# EAGLE design BMS_Rev3_SSR (EAGLE 6.5.0)
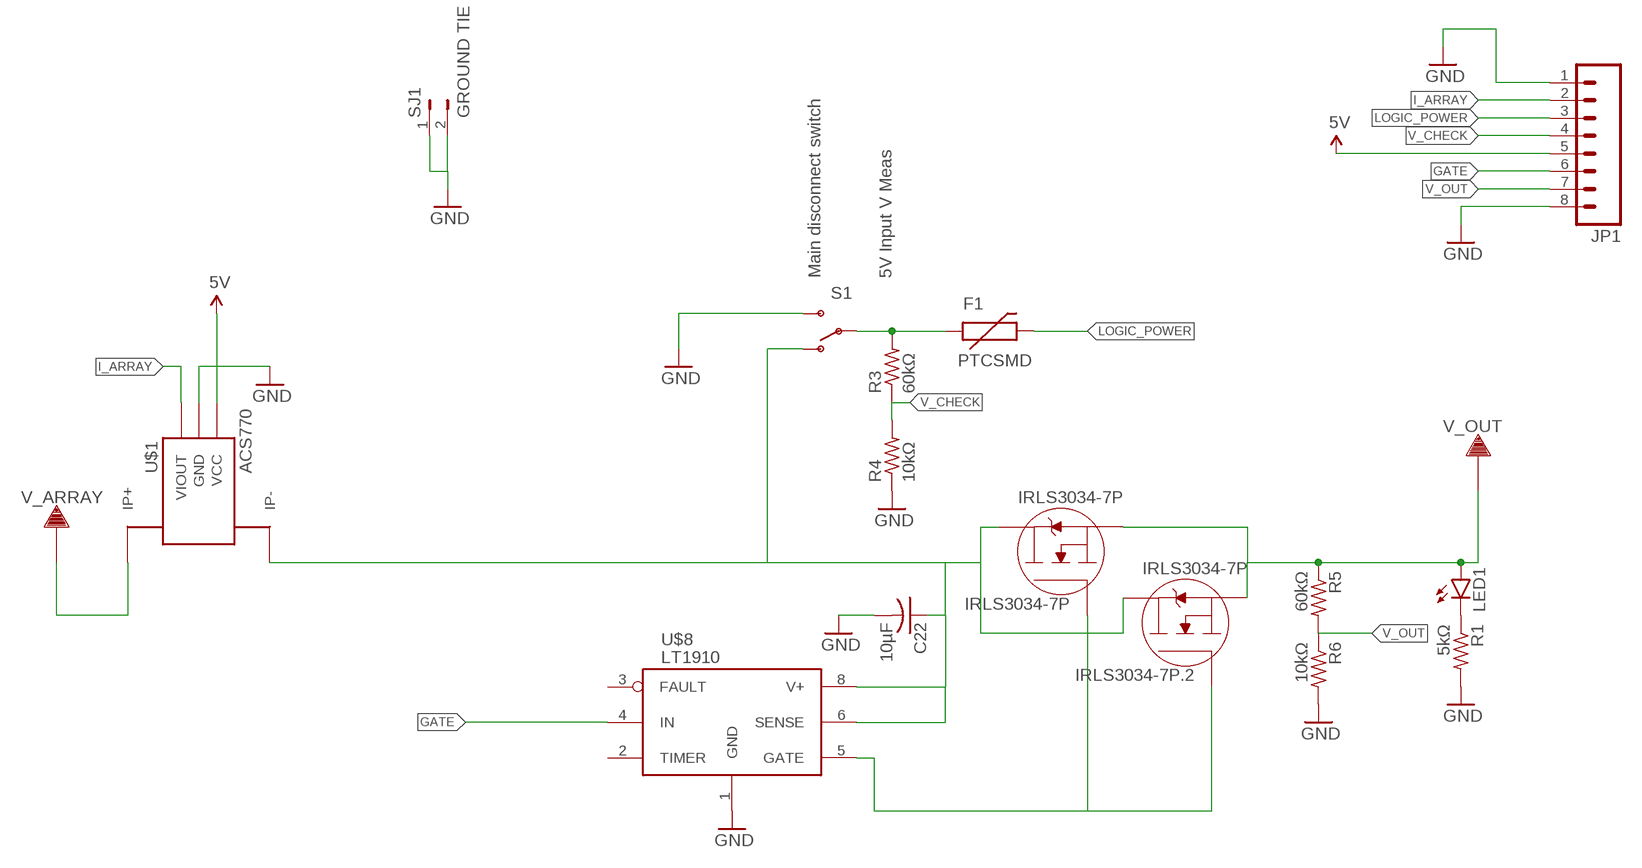
[diagram p0: schematic, sheet 1]

## Parts
C22  10µF  C-USC1206  [C1206]
F1  PTCSMD  [PTC-1206]
IRLS3034-7P  IRLS3034-7P  [D2PAK-7]
IRLS3034-7P.2  IRLS3034-7P  [D2PAK-7]
JP1  M08BM08B-SRSS-TB  [BM08B-SRSS-TB]
LED1  LED1206  [LED-1206]
R1  5kΩ  R-US_R1206  [R1206]
R3  60kΩ  R-US_R1206  [R1206]
R4  10kΩ  R-US_R1206  [R1206]
R5  60kΩ  R-US_R1206  [R1206]
R6  10kΩ  R-US_R1206  [R1206]
S1  SWITCH-SPDTPTH  [SWITCH-SPDT]
SJ1  GROUND TIE  JUMPER-PTH-2-NO  [PTH-JUMPER-2-NO_NO_SILK]
U$1  ACS770  [PFF_LEADFORM]
U$8  LT1910  [SO8]
V_ARRAY  TERMINAL_HOLE  [LARGE_TERMINAL_HOLE]
V_OUT  TERMINAL_HOLE  [LARGE_TERMINAL_HOLE]

## Nets
5V: JP1.5 U$1.1(VCC)
GATE: JP1.6 U$8.4(IN)
GND: C22.2 JP1.1 JP1.8 R1.2 R4.1 R6.2 S1.3(S) SJ1.1 SJ1.2 U$1.2(GND) U$8.1(GND)
I_ARRAY: JP1.2 U$1.3(VIOUT)
LOGIC_POWER: F1.2 JP1.3
N$1: IRLS3034-7P.2(SOURCE) IRLS3034-7P.2.2(SOURCE) IRLS3034-7P.2.3(SOURCE) IRLS3034-7P.2.4(SOURCE) IRLS3034-7P.2.5(SOURCE) IRLS3034-7P.2.6(SOURCE) IRLS3034-7P.3(SOURCE) IRLS3034-7P.4(SOURCE) IRLS3034-7P.5(SOURCE) IRLS3034-7P.6(SOURCE) LED1.A R5.1 V_OUT.P$1
N$2: U$1.4_1(IP+) U$1.4_2(IP+) U$1.4_3(IP+) U$1.4_4(IP+) U$1.4_5(IP+) U$1.4_6(IP+) U$1.4_7(IP+) U$1.4_8(IP+) U$1.4_9(IP+) U$1.4_10(IP+) U$1.4_11(IP+) U$1.4_12(IP+) U$1.4_13(IP+) U$1.4_14(IP+) U$1.4_15(IP+) U$1.4_16(IP+) U$1.4_B(IP+) U$1.4_T(IP+) V_ARRAY.P$1
N$3: C22.1 IRLS3034-7P.2.PAD(DRAIN) IRLS3034-7P.PAD(DRAIN) S1.1(O) U$1.5_1(IP-) U$1.5_2(IP-) U$1.5_3(IP-) U$1.5_4(IP-) U$1.5_5(IP-) U$1.5_6(IP-) U$1.5_7(IP-) U$1.5_8(IP-) U$1.5_9(IP-) U$1.5_10(IP-) U$1.5_11(IP-) U$1.5_12(IP-) U$1.5_13(IP-) U$1.5_14(IP-) U$1.5_15(IP-) U$1.5_16(IP-) U$1.5_B(IP-) U$1.5_T(IP-) U$8.6(SENSE) U$8.8(V+)
N$4: LED1.C R1.1
N$5: IRLS3034-7P.1(GATE) IRLS3034-7P.2.1(GATE) U$8.5(GATE)
N$6: F1.1 R3.2 S1.2(P)
V_CHECK: JP1.4 R3.1 R4.2
V_OUT: JP1.7 R5.2 R6.1
Unconnected: U$8.2(TIMER) U$8.3(FAULT)

## Notes on the sheet
- Main disconnect switch | 5V Input V Meas

## Library data of the parts
C22 = resistor:C-US: CAPACITOR, American symbol
F1 = SparkFun-PowerIC:PTC: Resettable Fuse PTC Resettable Fuse. Spark Fun Electronics SKU : COM-08357; PROD_ID: RES-11150
IRLS3034-7P IRLS3034-7P.2 = MRDT-2015-BMS:IRLS3034-7P: High-current SMD MOSFET
JP1 = SparkFun-Connectors:M08: Header 8 Standard 8-pin 0.1" header. Use with straight break away headers (SKU : PRT-00116), right angle break away headers (PRT-00553), swiss pins (PRT-00743), machine pins (PRT-00117), and female headers (PRT-00115).
LED1 = SparkFun-LED:LED: LEDs Standard schematic elements and footprints for 5mm, 3mm, 1206, and 0603 sized LEDs. 5mm - Spark Fun Electronics SKU : COM-00529 (and others)
R1 R3-R6 = resistor:R-US_: RESISTOR, American symbol
S1 = SparkFun-Electromechanical:SWITCH-SPDT: SPDT Switch Simple slide switch, Spark Fun Electronics SKU : COM-00102 DPDT SMT slide switch, AYZ0202, SWCH-08179
SJ1 = SparkFun-Passives:JUMPER-PTH-2-NO
U$1 = MRDT-2015-BMS:ACS770
U$8 = MRDT-2015-PowerBoard:LT1910
V_ARRAY V_OUT = MRDT-2015-PowerBoard:TERMINAL_HOLE

## Board
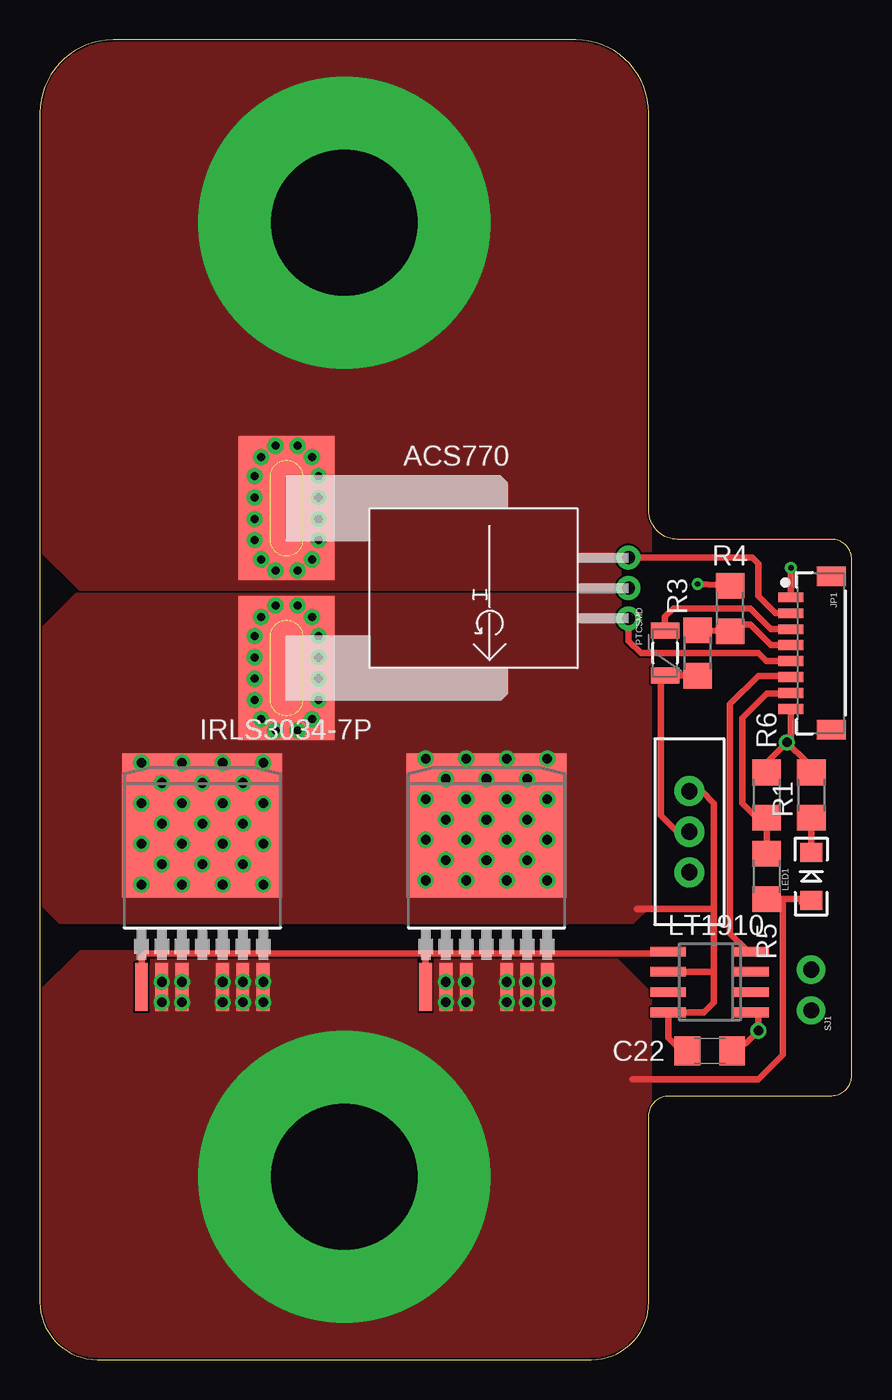
[diagram p1: board, top side]
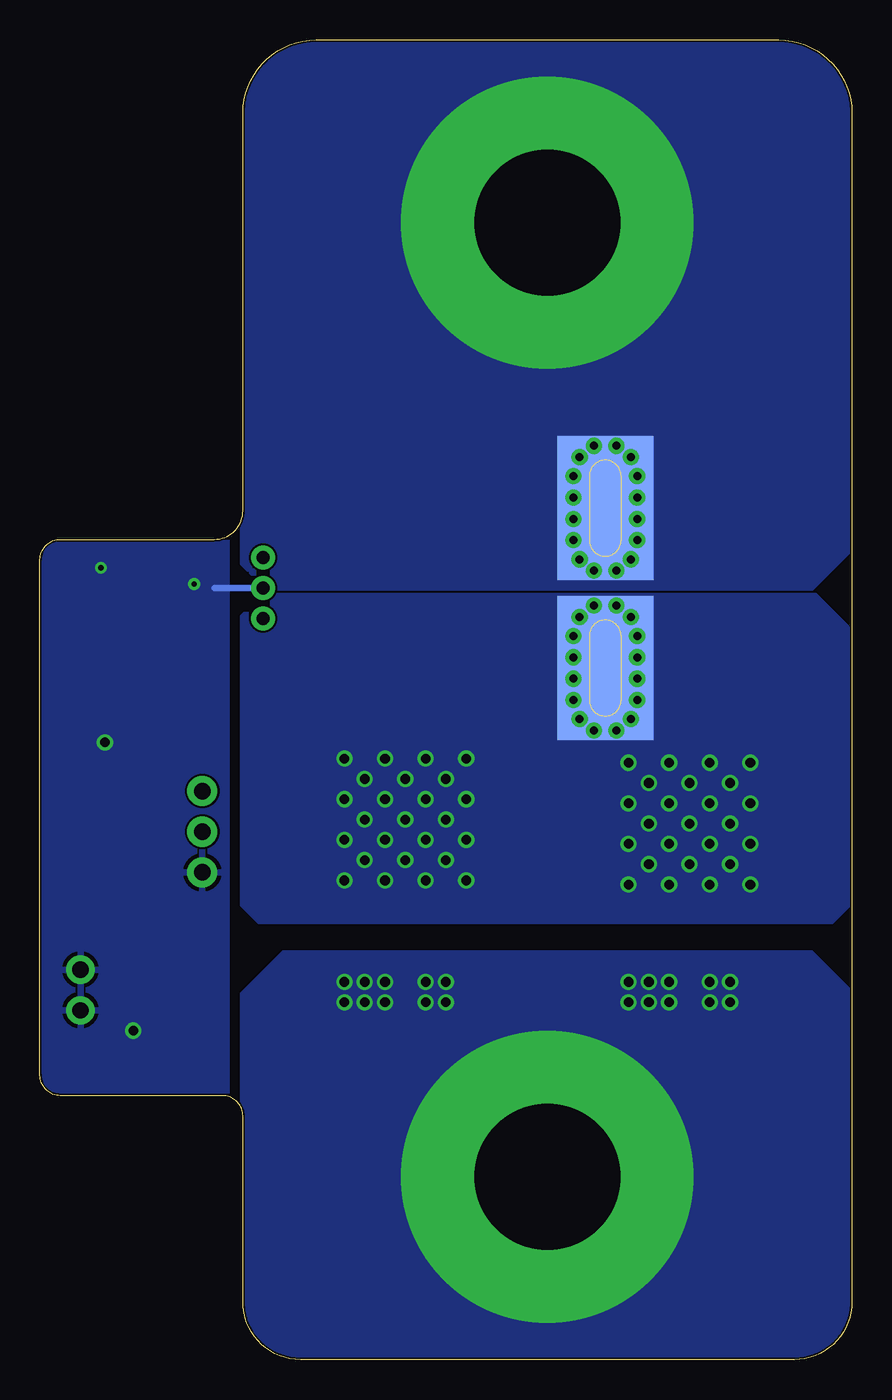
[diagram p2: board, bottom side, seen from below]

Size 50.8 x 82.55 mm. Coordinates in mm from the lower left corner, seen from the top.
Outline: 0,77.97 0,3.59 arc90 3.59,0 34.51,0 arc90 38.1,3.59 38.1,15.24 arc-90 39.37,16.51 49.53,16.51 arc90 50.8,17.78 50.8,50.04 arc90 49.53,51.31 39.9,51.31 arc-90 38.1,53.1 38.1,77.97 arc90 33.52,82.55 4.58,82.55 arc90 0,77.97
Copper layers (1*16): Top 0.035559375mm / dielectric 1.501140625mm / Bottom 0.035559375mm
Design rules "Heavier copper *": minimum track width 5mil, minimum drill 10mil, track to track 5mil, track to pad 5mil, pad to pad 5mil, via to via 5mil, smd to smd 5mil, copper to edge 5mil, drill to drill 5mil, minimum pad ring 10mil, minimum via ring 8mil, stop-mask expansion 4mil, vias tented up to drill 0mil, thermal gap 10mil

### Footprints (pad centres in the part's own frame; a part is rotated, then mirrored left to right if it is on the bottom)
C1206 = smd 1.6 x 1.8: 1 -1.4,0; 2 1.4,0
PTC-1206 = smd 1 x 1.8: 1 -1.4,0; 2 1.4,0
D2PAK-7 = smd 0.8 x 3: 1 -3.81,-9.207; 2 -2.54,-9.207; 3 -1.27,-9.207; 4 1.27,-9.207; 5 2.54,-9.207; 6 3.81,-9.207 | smd 10 x 9: PAD 0,0.895
BM08B-SRSS-TB = smd 0.6 x 1.55: 1 -3.5,0; 2 -2.5,0; 3 -1.5,0; 4 -0.5,0; 5 0.5,0; 6 1.5,0; 7 2.5,0; 8 3.5,0 | smd 1.2 x 1.8: P$9 4.8,2.525; P$10 -4.8,2.525
LED-1206 = smd 1.2 x 1.4: A -1.5,0; C 1.5,0
R1206 = smd 1.6 x 1.803: 1 -1.422,0; 2 1.422,0
SWITCH-SPDT = drill 1.016 pad 1.88: 1 0,2.54; 2 0,0; 3 0,-2.54
PTH-JUMPER-2-NO_NO_SILK = drill 1.016 pad 1.778: 1 -1.27,0; 2 1.27,0
PFF_LEADFORM = drill 0.8 pad 1.5: 1 -1.91,0; 2 0,0; 3 1.91,0 | drill 0.5: 4_1 3,23.4; 4_2 4.33,23.4; 4_3 5.67,23.4; 4_4 7,23.4; 4_5 8.2,23; 4_6 8.9,22.1; 4_7 8.9,20.7; 4_8 8.2,19.8; 4_9 7,19.4; 4_10 5.67,19.4; 4_11 4.33,19.4; 4_12 3,19.4; 4_13 1.8,19.8; 4_14 1.1,20.7; 4_15 1.1,22.1; 4_16 1.8,23; 5_1 -7,23.4; 5_2 -5.67,23.4; 5_3 -4.33,23.4; 5_4 -3,23.4; 5_5 -1.8,23; 5_6 -1.1,22.1; 5_7 -1.1,20.7; 5_8 -1.8,19.8; 5_9 -3,19.4; 5_10 -4.33,19.4; 5_11 -5.67,19.4; 5_12 -7,19.4; 5_13 -8.2,19.8; 5_14 -8.9,20.7; 5_15 -8.9,22.1; 5_16 -8.2,23 | smd 9 x 6 bottom: 4_B 5,21.4; 5_B -5,21.4 | smd 9 x 6: 4_T 5,21.4; 5_T -5,21.4
SO8 = smd 0.6 x 2.2: 1 -1.905,-2.6; 2 -0.635,-2.6; 3 0.635,-2.6; 4 1.905,-2.6; 5 1.905,2.6; 6 0.635,2.6; 7 -0.635,2.6; 8 -1.905,2.6
LARGE_TERMINAL_HOLE = drill 9.144 pad 18.288: P$1 0,0

### Placement (x,y rotation side)
C22  41.91,19.3 0 top
F1  39.12,44.2 90 top
IRLS3034-7P  10.16,32.51 0 top
IRLS3034-7P.2  27.94,32.51 0 top
JP1  46.99,44.2 270 top
LED1  48.26,30.23 90 top
R1  48.26,35.31 90 top
R3  41.15,44.2 270 top
R4  43.18,46.99 270 top
R5  45.47,30.23 90 top
R6  45.47,35.31 90 top
S1  40.64,33.02 0 top
SJ1  48.26,23.11 90 top
U$1  36.83,48.26 90 top
U$8  41.91,23.62 90 top
V_ARRAY  19.05,71.12 270 top
V_OUT  19.05,11.43 270 top

### Tracks (layer width: path | path; a pad name or v marks a point on that pad's centre or on a via)
5V
  Top 0.406: JP1.5 45.46,43.7 44.96,44.2 37.59,44.2 36.83,44.96 U$1.1
GATE
  Top 0.406: U$8.4 44.96,25.59 44.26,25.59 43.18,26.67 43.18,41 44.96,42.77 46.4,42.77 JP1.6
GND  (via drill 0.33, 0.6)
  Top 0.406: C22.2 44.2,19.81 v44.96,20.57 44.96,21.66 U$8.1 | R4.1 v41.15,48.51 | JP1.1 v46.99,49.53 | R6.2 45.47,37.34 v46.74,38.61 | R1.2 48.01,37.34 v46.74,38.61 | JP1.8 46.99,38.86 v46.74,38.61
  Bottom 0.406: U$1.2 39.88,48.26
  pour Bottom (rank 2): 39.12,56.9 39.12,7.62 62.48,7.62 62.48,57.91 40.13,57.91
I_ARRAY
  Top 0.406: JP1.2 46.01,46.7 44.96,47.75 44.96,49.78 44.57,50.17 U$1.3
LOGIC_POWER
  Top 0.406: JP1.3 45.74,45.7 44.45,46.99 39.62,46.99 39.12,46.48 F1.2
N$1  (via drill 0.6)
  Top 0.406: 37.08,17.53 44.96,17.53 46.48,19.05 46.48,28.62 45.65,28.62 R5.1 47.67,28.8 LED1.A 47.75,28.83 47.78,28.86 | 47.81,28.93 47.78,28.86 | 47.78,28.86 47.67,28.55
  other vias: 31.75,23.62 31.75,22.35 30.48,23.62 30.48,22.35 29.21,23.62 29.21,22.35 26.67,23.62 26.67,22.35 25.4,23.62 25.4,22.35 13.97,22.35 13.97,23.62 11.43,23.62 12.7,23.62 12.7,22.35 11.43,22.35 8.89,22.35 7.62,22.35 7.62,23.62 8.89,23.62
  pour Top (rank 3, no thermals): 38.1,22.86 38.1,-1.02 0,-1.02 0,22.86 2.54,25.4 35.56,25.4
  pour Bottom (rank 3, no thermals): 38.1,22.86 38.1,-1.02 0,-1.02 0,22.86 2.54,25.4 35.56,25.4
N$2
  pour Top (rank 4, no thermals): 38.1,82.8 0,82.55 0,50.8 2.54,48.26 36.58,48.26 38.1,49.78
  pour Bottom (rank 4, no thermals): 0,82.55 38.1,82.8 38.1,49.78 36.58,48.26 2.54,48.26 0,50.8
N$3  (via drill 0.6)
  Top 0.406: C22.1 39.88,19.56 39.31,20.13 U$8.8 41.53,21.72 42.16,22.35 42.16,24.38 | 42.16,24.38 42.16,28.19 | U$8.6 42.04,24.26 42.16,24.38 | 42.16,28.19 37.34,28.19 | 42.16,28.19 42.16,34.8 41.4,35.56 S1.1
  other vias: 24.13,37.59 30.48,36.32 31.75,37.59 29.21,32.51 31.75,35.05 27.94,33.78 26.67,32.51 25.4,31.24 26.67,29.97 24.13,35.05 25.4,33.78 27.94,31.24 31.75,29.97 31.75,32.51 30.48,33.78 30.48,31.24 29.21,37.59 29.21,29.97 25.4,36.32 24.13,29.97 26.67,35.05 24.13,32.51 27.94,36.32 29.21,35.05 26.67,37.59 12.7,36.07 11.43,37.34 8.89,34.8 6.35,37.34 7.62,36.07 10.16,33.53 13.97,34.8 12.7,33.53 12.7,30.99 13.97,37.34 8.89,37.34 10.16,36.07 7.62,33.53 7.62,30.99 8.89,29.72 6.35,34.8 6.35,32.26 8.89,32.26 6.35,29.72 11.43,34.8 11.43,32.26 11.43,29.72 10.16,30.99 13.97,32.26 13.97,29.72
  pour Top (no thermals): 36.83,47.75 38.1,46.48 38.1,28.45 37.08,27.43 1.27,27.43 0.25,28.45 0.25,45.72 2.29,47.75
  pour Bottom (rank 3, no thermals): 0.25,45.72 0.25,28.45 1.27,27.43 37.08,27.43 38.1,28.45 38.1,46.48 36.83,47.75 2.29,47.75
N$4
  Top 0.406: LED1.C R1.1
N$5
  Top 0.406: IRLS3034-7P.1 6.35,25.15 6.6,25.4 24.13,25.4 | IRLS3034-7P.2.1 24.13,25.4 | 24.13,25.4 38.35,25.4 39.62,25.47 U$8.5
N$6
  Top 0.406: 41.78,43.3 41.4,43.18 41.05,43.18 R3.2 41.13,42.8 F1.1 38.99,42.93 38.86,42.93 38.86,34.04 39.88,33.02 S1.2
V_CHECK
  Top 0.406: R3.1 R4.2 43.33,45.97 44.45,45.97 45.73,44.7 JP1.4
V_OUT
  Top 0.406: R5.2 R6.1 44.86,33.88 43.94,34.8 43.94,40.13 45.47,41.66 46.44,41.66 JP1.7